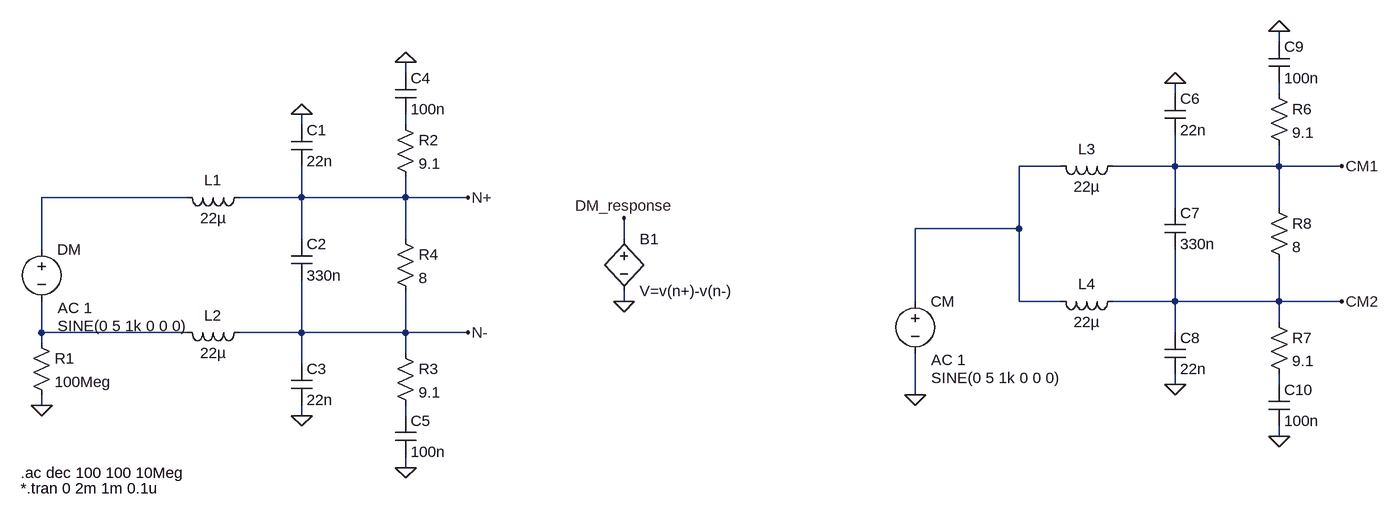
[diagram p0: schematic low_pass_filter.asc]
low_pass_filter.asc, the LTspice schematic file:
Version 4
SHEET 1 2212 680
WIRE 2048 -224 2048 -240
WIRE 704 -176 704 -192
WIRE 1888 -144 1888 -160
WIRE 2048 -144 2048 -160
WIRE 544 -96 544 -112
WIRE 704 -96 704 -112
WIRE 1712 -32 1648 -32
WIRE 1888 -32 1888 -80
WIRE 1888 -32 1792 -32
WIRE 2048 -32 2048 -64
WIRE 2048 -32 1888 -32
WIRE 2144 -32 2048 -32
WIRE 368 16 144 16
WIRE 544 16 544 -32
WIRE 544 16 448 16
WIRE 704 16 704 -16
WIRE 704 16 544 16
WIRE 800 16 704 16
WIRE 1888 32 1888 -32
WIRE 2048 32 2048 -32
WIRE 1648 64 1648 -32
WIRE 1648 64 1488 64
WIRE 544 80 544 16
WIRE 704 80 704 16
WIRE 1040 80 1040 48
WIRE 144 96 144 16
WIRE 1040 176 1040 160
WIRE 1488 176 1488 64
WIRE 1648 176 1648 64
WIRE 1712 176 1648 176
WIRE 1888 176 1888 96
WIRE 1888 176 1792 176
WIRE 2048 176 2048 112
WIRE 2048 176 1888 176
WIRE 2144 176 2048 176
WIRE 2048 208 2048 176
WIRE 144 224 144 176
WIRE 368 224 144 224
WIRE 544 224 544 144
WIRE 544 224 448 224
WIRE 704 224 704 160
WIRE 704 224 544 224
WIRE 800 224 704 224
WIRE 1888 224 1888 176
WIRE 144 240 144 224
WIRE 704 256 704 224
WIRE 544 272 544 224
WIRE 1888 304 1888 288
WIRE 2048 304 2048 288
WIRE 1488 320 1488 256
WIRE 144 336 144 320
WIRE 544 352 544 336
WIRE 704 352 704 336
WIRE 2048 384 2048 368
WIRE 704 432 704 416
FLAG 144 336 0
FLAG 544 352 0
FLAG 544 -112 0
FLAG 704 432 0
FLAG 704 -192 0
FLAG 800 16 N+
FLAG 800 224 N-
FLAG 1040 176 0
FLAG 1040 48 DM_response
FLAG 1488 320 0
FLAG 1888 304 0
FLAG 1888 -160 0
FLAG 2048 384 0
FLAG 2048 -240 0
FLAG 2144 -32 CM1
FLAG 2144 176 CM2
SYMBOL voltage 144 80 R0
WINDOW 3 25 134 Left 2
WINDOW 123 25 106 Left 2
WINDOW 39 0 0 Left 0
SYMATTR Value SINE(0 5 1k 0 0 0)
SYMATTR Value2 AC 1
SYMATTR InstName DM
SYMBOL res 128 224 R0
SYMATTR InstName R1
SYMATTR Value 100Meg
SYMBOL ind 464 0 R90
WINDOW 0 5 56 VBottom 2
WINDOW 3 32 56 VTop 2
SYMATTR InstName L1
SYMATTR Value 22µ
SYMBOL ind 464 208 R90
WINDOW 0 5 56 VBottom 2
WINDOW 3 32 56 VTop 2
SYMATTR InstName L2
SYMATTR Value 22µ
SYMBOL cap 528 -96 R0
SYMATTR InstName C1
SYMATTR Value 22n
SYMBOL cap 528 80 R0
SYMATTR InstName C2
SYMATTR Value 330n
SYMBOL cap 528 272 R0
SYMATTR InstName C3
SYMATTR Value 22n
SYMBOL res 688 -112 R0
SYMATTR InstName R2
SYMATTR Value 9.1
SYMBOL res 688 240 R0
SYMATTR InstName R3
SYMATTR Value 9.1
SYMBOL cap 688 -176 R0
SYMATTR InstName C4
SYMATTR Value 100n
SYMBOL cap 688 352 R0
SYMATTR InstName C5
SYMATTR Value 100n
SYMBOL res 688 64 R0
SYMATTR InstName R4
SYMATTR Value 8
SYMBOL bv 1040 64 R0
SYMATTR InstName B1
SYMATTR Value V=v(n+)-v(n-)
SYMBOL voltage 1488 160 R0
WINDOW 3 25 134 Left 2
WINDOW 123 25 106 Left 2
WINDOW 39 0 0 Left 0
SYMATTR Value SINE(0 5 1k 0 0 0)
SYMATTR Value2 AC 1
SYMATTR InstName CM
SYMBOL ind 1808 -48 R90
WINDOW 0 5 56 VBottom 2
WINDOW 3 32 56 VTop 2
SYMATTR InstName L3
SYMATTR Value 22µ
SYMBOL ind 1808 160 R90
WINDOW 0 5 56 VBottom 2
WINDOW 3 32 56 VTop 2
SYMATTR InstName L4
SYMATTR Value 22µ
SYMBOL cap 1872 -144 R0
SYMATTR InstName C6
SYMATTR Value 22n
SYMBOL cap 1872 32 R0
SYMATTR InstName C7
SYMATTR Value 330n
SYMBOL cap 1872 224 R0
SYMATTR InstName C8
SYMATTR Value 22n
SYMBOL res 2032 -160 R0
SYMATTR InstName R6
SYMATTR Value 9.1
SYMBOL res 2032 192 R0
SYMATTR InstName R7
SYMATTR Value 9.1
SYMBOL cap 2032 -224 R0
SYMATTR InstName C9
SYMATTR Value 100n
SYMBOL cap 2032 304 R0
SYMATTR InstName C10
SYMATTR Value 100n
SYMBOL res 2032 16 R0
SYMATTR InstName R8
SYMATTR Value 8
TEXT 112 440 Left 2 !.ac dec 100 100 10Meg
TEXT 112 464 Left 2 !*.tran 0 2m 1m 0.1u

The netlist it stands for:
* low_pass_filter.asc
V§DM N004 N005 SINE(0 5 1k 0 0 0) AC 1
R1 N005 0 100Meg
L1 N+ N004 22µ
L2 N- N005 22µ
C1 0 N+ 22n
C2 N+ N- 330n
C3 N- 0 22n
R2 N002 N+ 9.1
R3 N- N007 9.1
C4 0 N002 100n
C5 N007 0 100n
R4 N+ N- 8
B1 DM_response 0 V=v(n+)-v(n-)
V§CM N003 0 SINE(0 5 1k 0 0 0) AC 1
L3 CM1 N003 22µ
L4 CM2 N003 22µ
C6 0 CM1 22n
C7 CM1 CM2 330n
C8 CM2 0 22n
R6 N001 CM1 9.1
R7 CM2 N006 9.1
C9 0 N001 100n
C10 N006 0 100n
R8 CM1 CM2 8
.ac dec 100 100 10Meg
*.tran 0 2m 1m 0.1u
.backanno
.end